# EAGLE design Shield_schematic_MMS (EAGLE 8.4.0)
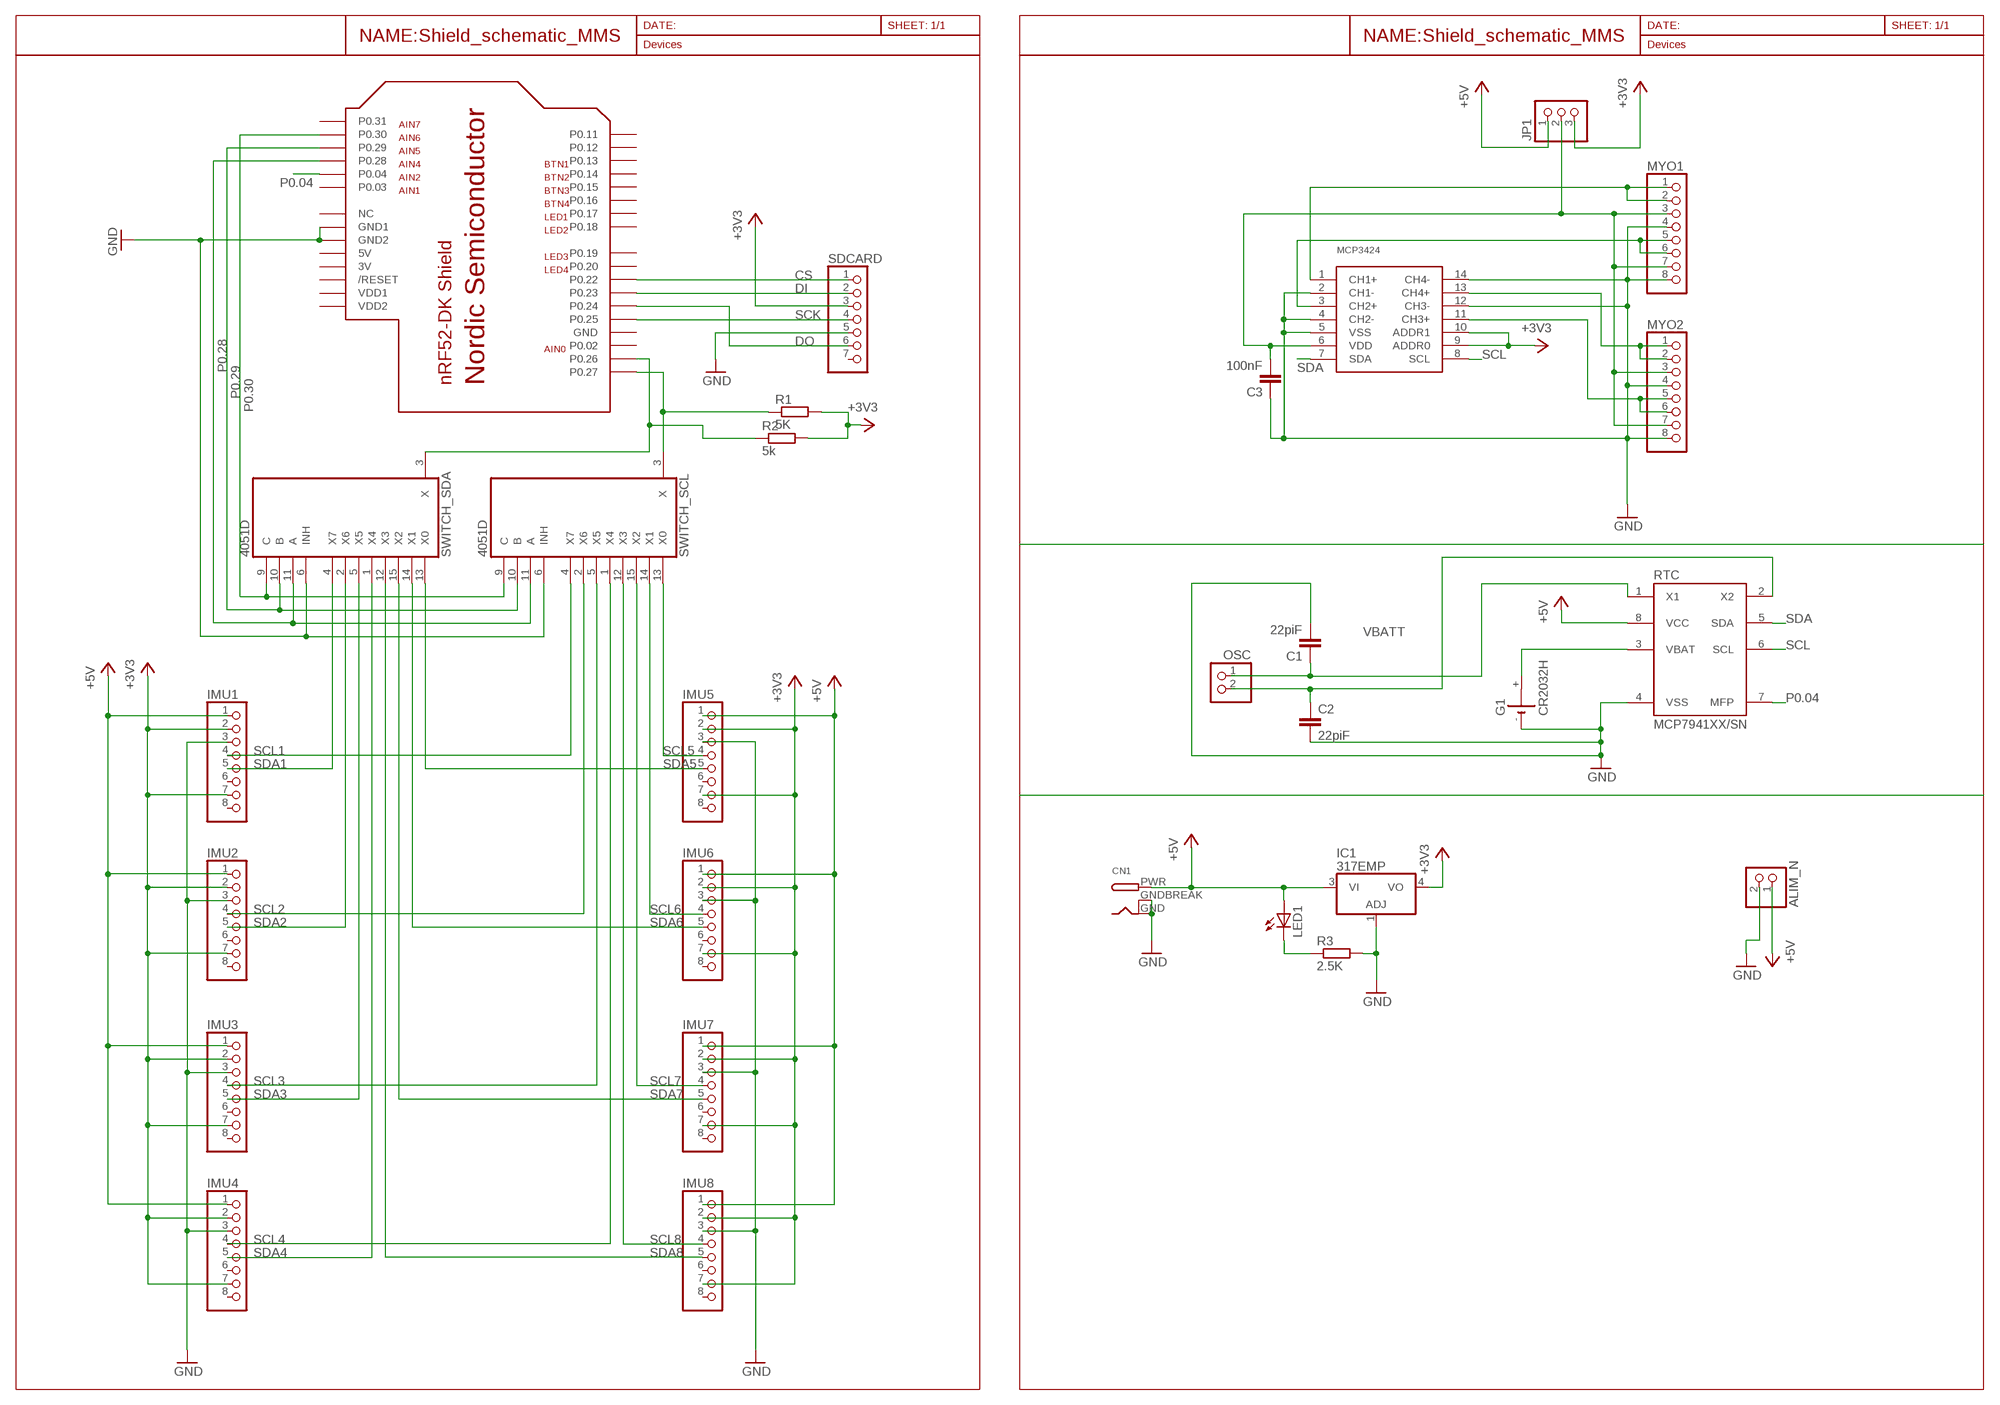
[diagram p0: schematic, sheet 1]

## Parts
ALIM_N  PINHD-1X2  [1X02]
C1  22piF  C2.5/2  [C2.5-2]
C2  22piF  C2.5/2  [C2.5-2]
C3  100nF  C2.5/2  [C2.5-2]
CN1  DCBARRELPTH  [DCJACK_2MM_PTH]
G1  CR2032H  [CR2032H]
IC1  317EMP  [SOT223]
IMU1  PINHD-1X8  [1X08]
IMU2  PINHD-1X8  [1X08]
IMU3  PINHD-1X8  [1X08]
IMU4  PINHD-1X8  [1X08]
IMU5  PINHD-1X8  [1X08]
IMU6  PINHD-1X8  [1X08]
IMU7  PINHD-1X8  [1X08]
IMU8  PINHD-1X8  [1X08]
JP1  PINHD-1X3  [1X03]
LED1  LEDCHIPLED_1206  [CHIPLED_1206]
MYO1  PINHD-1X8  [1X08]
MYO2  PINHD-1X8  [1X08]
OSC  PINHD-1X2  [1X02]
R1  5K  R-EU_M1206  [M1206]
R2  5k  R-EU_M1206  [M1206]
R3  2.5K  R-EU_M1206  [M1206]
RTC  MCP7941XX/SN  [SO8]
SDCARD  PINHD-1X7  [1X07]
SWITCH_SCL  4051D  [SO16]
SWITCH_SDA  4051D  [SO16]
U$2  NRF52-SHIELD-NOTEXT  [NRF52-SHIELD]
U$3  MCP3424  [SO14]

## Nets
+3V3: IC1.4(VO) IMU1.2 IMU1.7 IMU2.2 IMU2.7 IMU3.2 IMU3.7 IMU4.2 IMU4.7 IMU5.2 IMU5.7 IMU6.2 IMU6.7 IMU7.2 IMU7.7 IMU8.2 IMU8.7 JP1.3 R1.2 R2.2 SDCARD.3 U$3.9(ADDR0) U$3.10(ADDR1)
+5V: ALIM_N.1 CN1.PWR IC1.3(VI) IMU1.1 IMU2.1 IMU3.1 IMU4.1 IMU5.1 IMU6.1 IMU7.1 IMU8.1 JP1.1 LED1.A RTC.8(VCC)
CH1: MYO1.1 MYO1.2 U$3.1(CH1+)
CH2: MYO1.5 MYO1.6 U$3.3(CH2+)
CH3: MYO2.5 MYO2.6 U$3.11(CH3+)
CH4: MYO2.1 MYO2.2 U$3.13(CH4+)
CS: SDCARD.1 U$2.P22(P0.22)
DI: SDCARD.2 U$2.P23(P0.23)
DO: SDCARD.6 U$2.P24(P0.24)
GND: ALIM_N.2 C1.2 C2.2 C3.1 CN1.GND CN1.GNDBREAK G1.- IC1.1(ADJ) IMU1.3 IMU2.3 IMU3.3 IMU4.3 IMU5.3 IMU6.3 IMU7.3 IMU8.3 MYO1.4 MYO1.8 MYO2.4 MYO2.8 R3.2 RTC.4(VSS) SDCARD.5 SWITCH_SCL.6(INH) SWITCH_SDA.6(INH) U$2.GND1 U$2.GND2 U$3.2(CH1-) U$3.4(CH2-) U$3.5(VSS) U$3.12(CH3-) U$3.14(CH4-)
N$12: LED1.C R3.1
P0.04: RTC.7(MFP) U$2.P04(P0.04)
P0.28: SWITCH_SCL.11(A) SWITCH_SDA.11(A) U$2.P28(P0.28)
P0.29: SWITCH_SCL.10(B) SWITCH_SDA.10(B) U$2.P29(P0.29)
P0.30: SWITCH_SCL.9(C) SWITCH_SDA.9(C) U$2.P30(P0.30)
SCK: SDCARD.4 U$2.P25(P0.25)
SCL: R1.1 RTC.6(SCL) SWITCH_SCL.3(X) U$2.P27(P0.27) U$3.8(SCL)
SCL1: IMU1.4 SWITCH_SCL.4(X7)
SCL2: IMU2.4 SWITCH_SCL.2(X6)
SCL3: IMU3.4 SWITCH_SCL.5(X5)
SCL4: IMU4.4 SWITCH_SCL.1(X4)
SCL5: IMU5.4 SWITCH_SCL.13(X0)
SCL6: IMU6.4 SWITCH_SCL.14(X1)
SCL7: IMU7.4 SWITCH_SCL.15(X2)
SCL8: IMU8.4 SWITCH_SCL.12(X3)
SDA: R2.1 RTC.5(SDA) SWITCH_SDA.3(X) U$2.P26(P0.26) U$3.7(SDA)
SDA1: IMU1.5 SWITCH_SDA.4(X7)
SDA2: IMU2.5 SWITCH_SDA.2(X6)
SDA3: IMU3.5 SWITCH_SDA.5(X5)
SDA4: IMU4.5 SWITCH_SDA.1(X4)
SDA5: IMU5.5 SWITCH_SDA.13(X0)
SDA6: IMU6.5 SWITCH_SDA.14(X1)
SDA7: IMU7.5 SWITCH_SDA.15(X2)
SDA8: IMU8.5 SWITCH_SDA.12(X3)
VBATT: G1.+ RTC.3(VBAT)
VDD: C3.2 JP1.2 MYO1.3 MYO1.7 MYO2.3 MYO2.7 U$3.6(VDD)
X1: C1.1 OSC.1 RTC.1(X1)
X2: C2.1 OSC.2 RTC.2(X2)
Unconnected: G1.+@1(+) IMU1.6 IMU1.8 IMU2.6 IMU2.8 IMU3.6 IMU3.8 IMU4.6 IMU4.8 IMU5.6 IMU5.8 IMU6.6 IMU6.8 IMU7.6 IMU7.8 IMU8.6 IMU8.8 SDCARD.7 U$2.NC U$2.P02(P0.02) U$2.P03(P0.03) U$2.P11(P0.11) U$2.P12(P0.12) U$2.P13(P0.13) U$2.P14(P0.14) U$2.P15(P0.15) U$2.P16(P0.16) U$2.P17(P0.17) U$2.P18(P0.18) U$2.P19(P0.19) U$2.P20(P0.20) U$2.P31(P0.31) U$2.RESET(/RESET)

## Power pins joined to a net without a drawn wire
3V: U$2.3V
5V: U$2.5V
GND: SWITCH_SCL.8(GND) SWITCH_SDA.8(GND) U$2.GND
VCC: SWITCH_SCL.16(VCC) SWITCH_SDA.16(VCC)
VDD1: U$2.VDD2(VDD1)
VDD2: U$2.VDD1(VDD2)
VEE: SWITCH_SCL.7(VEE) SWITCH_SDA.7(VEE)

## Library data of the parts
ALIM_N OSC = pinhead:PINHD-1X2: PIN HEADER
C1-C3 = capacitor-wima:C: CAPACITOR naming: grid - package width
CN1 = adafruit:DCBARREL: 2.0mm DC Barrel Jack DCJACK_2MM_PTH - Through Hole Jack (4UConnector: 05537)
G1 = battery:CR2032H: LI BATTERY Varta
IC1 = linear:*317: Positive VOLTAGE REGULATOR
IMU1-IMU8 MYO1 MYO2 = pinhead:PINHD-1X8: PIN HEADER
JP1 = pinhead:PINHD-1X3: PIN HEADER
LED1 = adafruit:LED: LED OSRAM: - CHIPLED LG R971, LG N971, LY N971, LG Q971, LY Q971, LO R971, LY R971 LH N974, LH R974 LS Q976, LO Q976, LY Q976 LO Q996 - Hyper CHIPLED LW Q18S LB Q993, LB Q99A, LB R99A - SideLED LS A670, LO A670, LY A670, LG A670, LP A670 LB A673, LV A673, LT A673, LW A673 LH A674 LY A675 LS A676, LA A676, LO A676, LY A676, LW A676 LS A679, LY A679, LG A679 - Hyper Micro SIDELED® LS Y876, LA Y876, LO Y876, LY Y876 LT Y87S - SmartLED LW L88C, LW L88S LB L89C, LB L89S, LG L890 LS L89K, LO L89K, LY L89K LS L896, LA L896, LO L896, LY L896 - TOPLED LS T670, LO T670, LY T670, LG T670, LP T670 LSG T670, LSP T670, LSY T670, LOP T670, LYG T670 LG T671, LOG T671, LSG T671 LB T673, LV T673, LT T673, LW T673 LH T674 LS T676, LA T676, LO T676, LY T676, LB T676, LH T676, LSB T676, LW T676 LB T67C, LV T67C, LT T67C, LS T67K, LO T67K, LY T67K, LW E67C LS E67B, LA E67B, LO E67B, LY E67B, LB E67C, LV E67C, LT E67C LW T67C LS T679, LY T679, LG T679 LS T770, LO T770, LY T770, LG T770, LP T770 LB T773, LV T773, LT T773, LW T773 LH T774 LS E675, LA E675, LY E675, LS T675 LS T776, LA T776, LO T776, LY T776, LB T776 LHGB T686 LT T68C, LB T68C - Hyper Mini TOPLED® LB M676 - Mini TOPLED Santana® LG M470 LS M47K, LO M47K, LY M47K Source: http://www.osram.convergy.de/
R1-R3 = resistor:R-EU_: RESISTOR, European symbol
RTC = _hhn_MCP7941X:MCP7941*?: Microchip MCP79410 / MCP79411 / MCP79412 I²C Real Time CLock/Calendar with Unique ID Rev. 5.0.0 as of 2013-10-23, for EAGLE 5+ Changelog 5.0.0 (initial) MCP79410XI/YY X: Unique ID 0: blank 1: EUI-48 2: EUI-96 I: Temperature Range (Industrial) /YY: Package /MS: MSOP8_.65 (8-Lead Micro Small Outline Package, 0.65mm pitch) /SN: SOIC8 (8-Lead Small Outline [Narrow], 3.9mm body) /ST: TSSOP8 (8-Lead Thin Schrink Small Outline, 4.4mm body) Source: http://www.microchip.com Author: Dipl.-Ing. FH Rainer Bayer Heilbronn University HHN http://www.hs-heilbronn.de/rainer.bayer · rainer.bayer@hs-heilbronn.de Engineering office ing-rb: http://www.ing-rb.de/ · eagle@ing-rb.de Lectureship dozent-rb: http://www.dozent-rb.de/ · eagle@dozent-rb.de
SDCARD = pinhead:PINHD-1X7: PIN HEADER
SWITCH_SCL SWITCH_SDA = 40xx:4051: 8-channel ANALOG MULTIPLEXER
U$2 = nrf52-shield_modif:NRF52-SHIELD: nRF5 devkit shield
U$3 = mcp3424:MCP3424

## Board
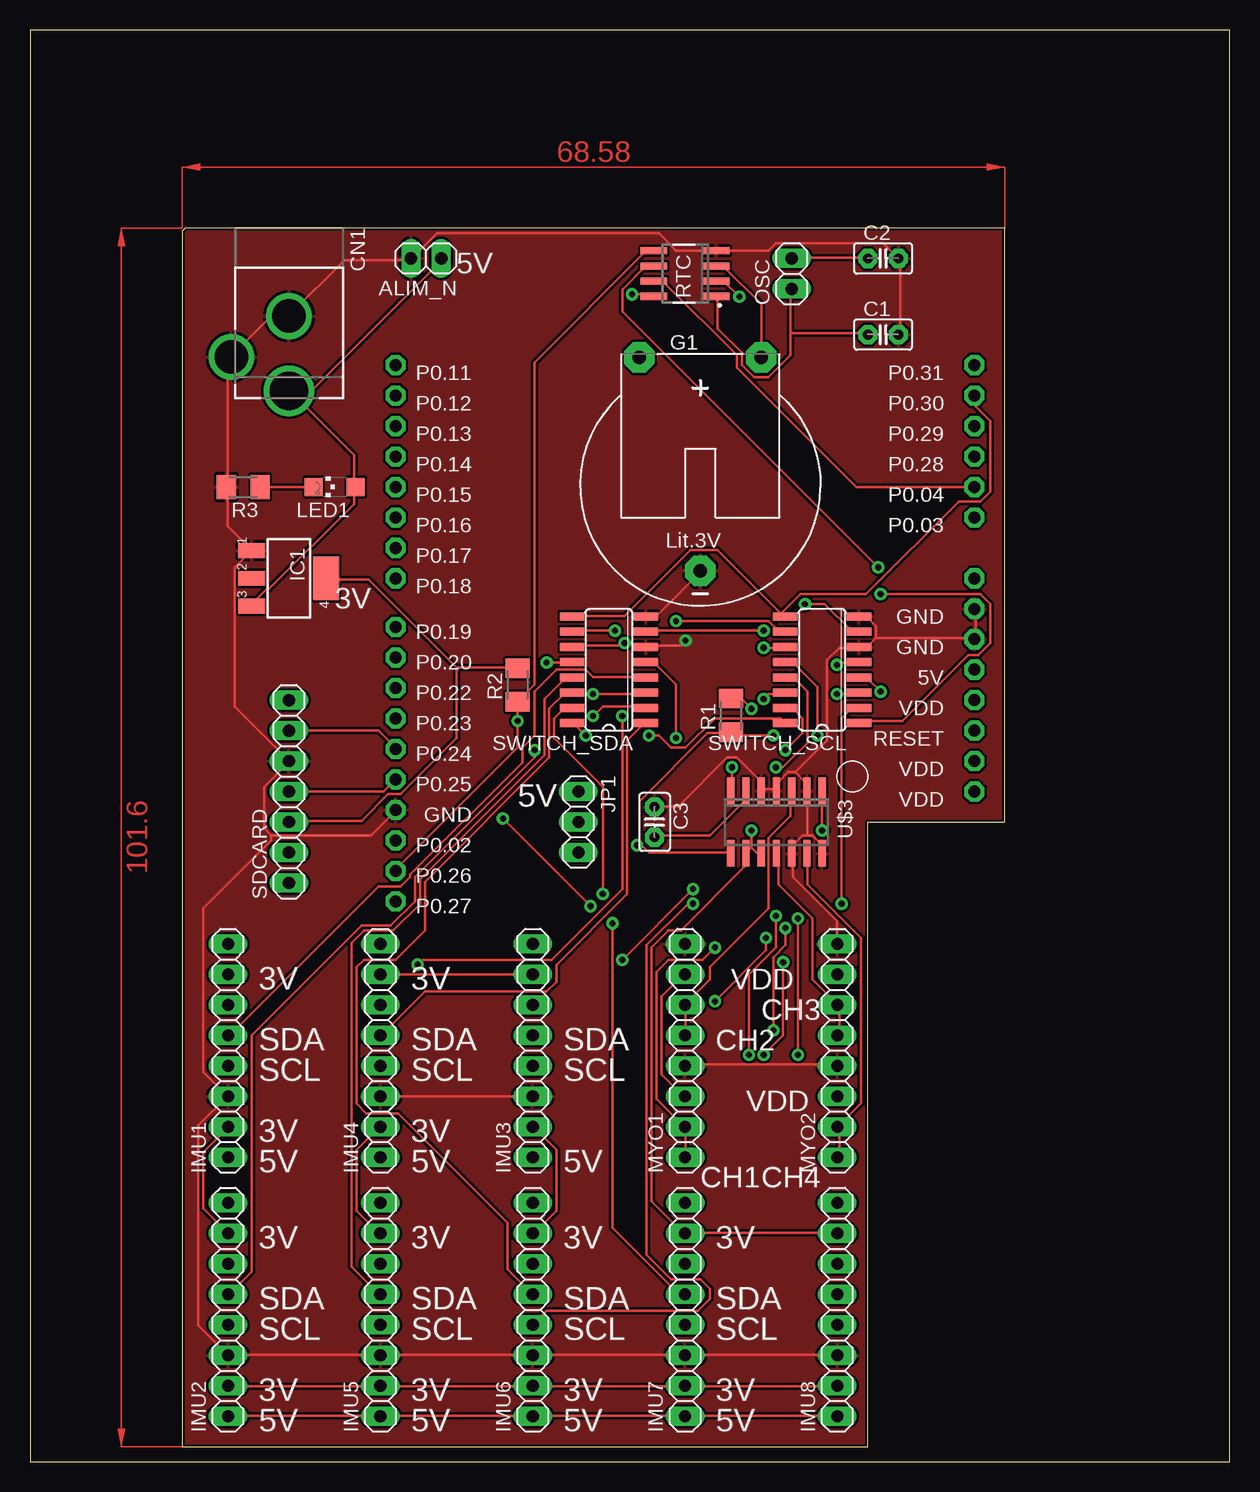
[diagram p1: board, top side]
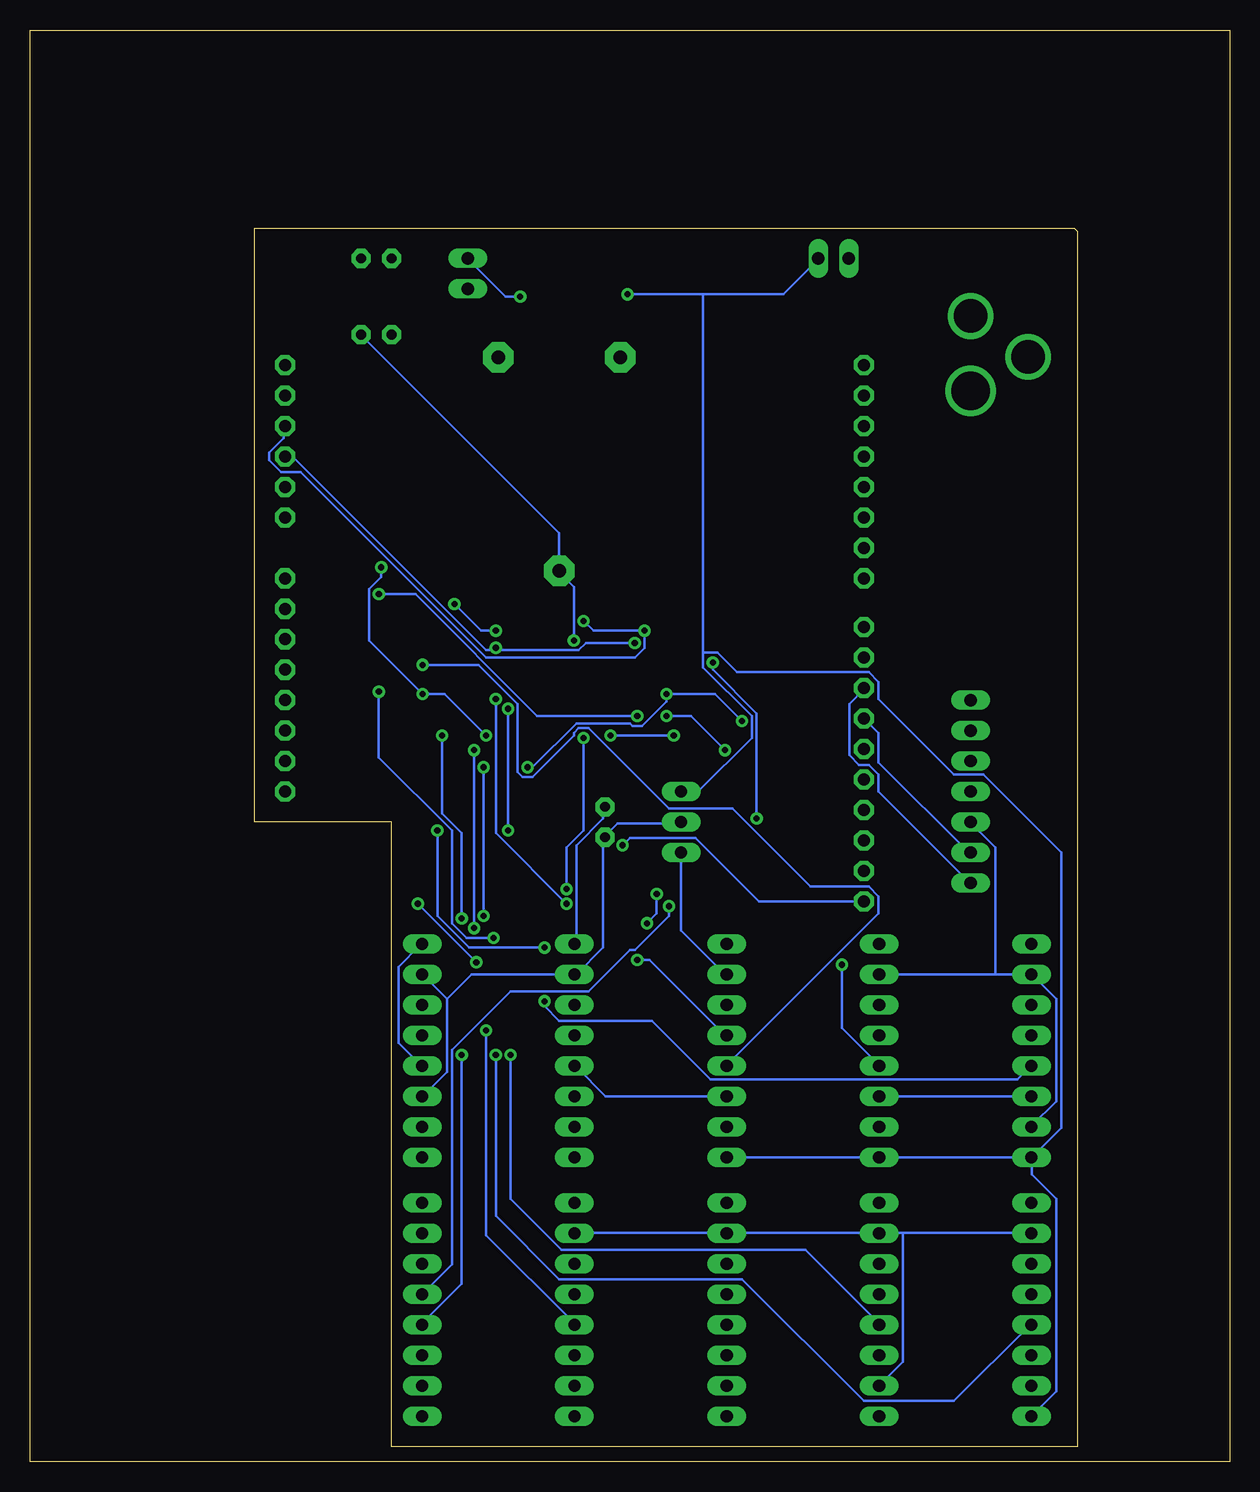
[diagram p2: board, bottom side, seen from below]

Size 100 x 119.37 mm. Coordinates in mm from the lower left corner, seen from the top.
Outline: 0,0 100,0 100,119.37 0,119.37 0,0
Copper layers (1*16): Top 0.035mm / dielectric 1.5mm / Bottom 0.035mm
Design rules "SparkFun": minimum track width 8mil, minimum drill 20mil, track to track 8mil, track to pad 8mil, pad to pad 8mil, via to via 8mil, smd to smd 8mil, copper to edge 8mil, drill to drill 8mil, minimum pad ring 12mil, minimum via ring 10mil, stop-mask expansion 4mil, vias tented up to drill 20mil, thermal gap 10mil

### Footprints (pad centres in the part's own frame; a part is rotated, then mirrored left to right if it is on the bottom)
1X02 = drill 1.016 long: 1 -1.27,0; 2 1.27,0
C2.5-2 = drill 0.813 pad 1.6 octagon: 1 -1.27,0; 2 1.27,0
DCJACK_2MM_PTH = drill 2.8: GND 0,7.35; GNDBREAK 4.8,10.75 | drill 3.2: PWR 0,13.6
CR2032H = drill 1.118 pad 2.54 octagon: + 5.08,10.795; +@1 -5.08,10.795; - 0,-6.985
SOT223 = smd 1.219 x 2.235: 1 -2.311,-3.099; 2 0,-3.099; 3 2.311,-3.099 | smd 3.6 x 2.2: 4 0,3.099
1X08 = drill 1.016 long: 1 -8.89,0; 2 -6.35,0; 3 -3.81,0; 4 -1.27,0; 5 1.27,0; 6 3.81,0; 7 6.35,0; 8 8.89,0
1X03 = drill 1.016 long: 1 -2.54,0; 2 0,0; 3 2.54,0
CHIPLED_1206 = smd 1.5 x 1.5: A 0,-1.75; C 0,1.75
M1206 = smd 1.6 x 2: 1 -1.4,0; 2 1.4,0
SO8 = smd 0.6 x 2.2: 1 -1.905,-2.6; 2 -0.635,-2.6; 3 0.635,-2.6; 4 1.905,-2.6; 5 1.905,2.6; 6 0.635,2.6; 7 -0.635,2.6; 8 -1.905,2.6
1X07 = drill 1.016 long: 1 -7.62,0; 2 -5.08,0; 3 -2.54,0; 4 0,0; 5 2.54,0; 6 5.08,0; 7 7.62,0
SO16 = smd 0.66 x 2.032: 1 -4.445,-3.073; 2 -3.175,-3.073; 3 -1.905,-3.073; 4 -0.635,-3.073; 5 0.635,-3.073; 6 1.905,-3.073; 7 3.175,-3.073; 8 4.445,-3.073; 9 4.445,3.073; 10 3.175,3.073; 11 1.905,3.073; 12 0.635,3.073; 13 -0.635,3.073; 14 -1.905,3.073; 15 -3.175,3.073; 16 -4.445,3.073
NRF52-SHIELD = drill 1 pad 1.676 octagon: 3V 62.23,1.27; 5V 64.77,1.27; GND 53.086,49.53; GND1 69.85,1.27; GND2 67.31,1.27; NC 72.39,1.27; P02 50.546,49.53; P03 77.47,1.27; P04 80.01,1.27; P11 90.17,49.53; P12 87.63,49.53; P13 85.09,49.53; P14 82.55,49.53; P15 80.01,49.53; P16 77.47,49.53; P17 74.93,49.53; P18 72.39,49.53; P19 68.326,49.53; P20 65.786,49.53; P22 63.246,49.53; P23 60.706,49.53; P24 58.166,49.53; P25 55.626,49.53; P26 48.006,49.53; P27 45.466,49.53; P28 82.55,1.27; P29 85.09,1.27; P30 87.63,1.27; P31 90.17,1.27; RESET 59.69,1.27; VDD1 57.15,1.27; VDD2 54.61,1.27
SO14 = smd 0.6 x 2.2: 1 -3.81,-2.6; 2 -2.54,-2.6; 3 -1.27,-2.6; 4 0,-2.6; 5 1.27,-2.6; 6 2.54,-2.6; 7 3.81,-2.6; 8 3.81,2.6; 9 2.54,2.6; 10 1.27,2.6; 11 0,2.6; 12 -1.27,2.6; 13 -2.54,2.6; 14 -3.81,2.6

### Placement (x,y rotation side)
ALIM_N  33.02,100.33 180 top
C1  71.12,93.98 0 top
C2  71.12,100.33 0 top
C3  52.07,53.34 270 top
CN1  21.59,102.87 180 top
G1  55.88,81.28 0 top
IC1  21.59,73.66 270 top
IMU1  16.51,34.29 90 top
IMU2  16.51,12.7 90 top
IMU3  41.91,34.29 90 top
IMU4  29.21,34.29 90 top
IMU5  29.21,12.7 90 top
IMU6  41.91,12.7 90 top
IMU7  54.61,12.7 90 top
IMU8  67.31,12.7 90 top
JP1  45.72,53.34 270 top
LED1  25.4,81.28 90 top
MYO1  54.61,34.29 90 top
MYO2  67.31,34.29 90 top
OSC  63.5,99.06 90 top
R1  58.42,62.23 90 top
R2  40.64,64.77 90 top
R3  17.78,81.28 180 top
RTC  54.61,99.06 90 top
SDCARD  21.59,55.88 90 top
SWITCH_SCL  66.04,66.04 90 top
SWITCH_SDA  48.26,66.04 90 top
U$2  80.01,1.27 90 top
U$3  62.23,53.34 180 top

### Tracks (layer width: path | path; a pad name or v marks a point on that pad's centre or on a via)
+3V3  (via drill 0.51)
  Top 0.203: 35.56,66.24 40.64,66.24 R2.2 | 35.56,66.24 28.25,73.56 24.79,73.56 IC1.4 | IMU4.7 IMU3.7 | 35.56,66.24 35.56,60.35 30.89,55.68 29.87,55.68 27.64,53.44 21.74,53.44 SDCARD.3 | IMU2.2 16.66,6.3 29.06,6.3 IMU5.2 29.26,6.3 41.86,6.3 IMU6.2 42.06,6.3 54.46,6.3 IMU7.2 54.66,6.3 67.26,6.3 IMU8.2 | IMU2.7 14.43,21.13 14.43,25.81 16.46,27.84 IMU1.2 | IMU5.7 29.06,19.1 27.23,20.93 27.23,26.01 29.06,27.84 IMU4.2 | v60.15,62.79 59.33,63.6 58.52,63.6 R1.2 | 60.15,51.21 v60.15,52.63 | 60.15,51.21 59.74,50.8 U$3.9 59.54,50.6 59.54,49.58 54.25,44.3 53.24,44.3 51.82,42.88 51.82,21.74 54.46,19.1 IMU7.7 54.66,19.1 67.26,19.1 IMU8.7 | 60.15,51.21 60.55,50.8 60.96,50.8 U$3.10 | IMU6.7 42.06,19.1 43.89,20.93 43.89,26.01 42.06,27.84 IMU3.2
  Bottom 0.203: JP1.3 45.72,44.3 42.06,40.64 IMU3.7 | IMU4.7 19.51,40.64 | 19.51,40.64 IMU1.7 16.46,40.64 14.43,38.61 14.43,30.07 16.46,28.04 IMU1.2 | 19.51,40.64 19.51,51.21 21.54,53.24 SDCARD.3 | 27.23,19.1 29.06,19.1 IMU5.7 29.26,19.1 41.86,19.1 IMU6.7 42.06,19.1 54.46,19.1 IMU7.7 | 27.23,19.1 16.66,19.1 IMU2.7 | v60.15,52.63 v60.15,62.79 | IMU5.2 27.23,8.33 27.23,19.1
+5V  (via drill 0.51)
  Top 0.203: IMU2.1 16.66,3.86 29.06,3.86 IMU5.1 29.26,3.86 41.86,3.86 IMU6.1 42.06,3.86 54.46,3.86 IMU7.1 54.66,3.86 67.26,3.86 IMU8.1 | 27.03,81.28 27.03,83.92 22.55,88.39 | 22.55,88.39 21.74,89.2 CN1.PWR 22.55,88.39 | 27.03,81.28 27.03,79.86 19.91,72.75 19.71,72.75 18.49,71.53 IC1.3 | 27.03,81.28 LED1.A | v50.19,97.33 51.82,97.33 RTC.8 | 22.55,88.39 34.34,100.18 ALIM_N.1
  Bottom 0.203: IMU3.1 IMU4.1 IMU1.1 16.46,25.4 | 16.46,25.4 16.46,23.98 14.43,21.95 14.43,5.89 IMU2.1 | 43.89,97.33 37.19,97.33 34.34,100.18 ALIM_N.1 | 43.89,97.33 v50.19,97.33 | JP1.1 44.3,55.88 39.83,60.35 39.83,62.18 43.89,66.24 43.89,67.46 | 43.89,97.33 43.89,67.46 | 16.46,25.4 14.02,27.84 14.02,50.8 20.52,57.3 22.96,57.3 29.26,63.6 29.26,65.02 30.07,65.84 41.05,65.84 42.67,67.46 43.89,67.46
CH1  (via drill 0.51)
  Top 0.203: v66.04,52.63 U$3.1 | v57.1,42.88 56.08,41.86 53.24,41.86 52.22,40.84 52.22,30.28 54.46,28.04 MYO1.2 54.66,27.84 54.66,25.4 MYO1.1
  Bottom 0.203: v66.04,52.63 66.04,45.52 63.4,42.88 v57.1,42.88
CH2
  Top 0.203: U$3.3 63.4,55.88 63.4,53.85 61.57,52.02 61.57,46.13 56.69,41.25 56.69,40.23 54.66,38.2 MYO1.6 54.66,38 54.66,35.56 MYO1.5
CH3
  Top 0.203: U$3.11 62.38,50.6 62.38,48.16 65.23,45.31 65.23,40.23 67.26,38.2 MYO2.6 67.46,38 67.46,35.56 MYO2.5
CH4
  Top 0.203: U$3.13 64.82,50.6 64.82,48.16 69.29,43.69 69.29,29.87 67.46,28.04 MYO2.2 67.46,27.84 67.46,25.4 MYO2.1
CS
  Bottom 0.203: SDCARD.1 21.74,48.36 29.26,55.88 29.26,57.3 30.07,58.12 30.89,58.12 31.7,58.93 31.7,63.2 30.48,64.41 U$2.P22
DI
  Bottom 0.203: U$2.P23 29.26,60.76 29.26,58.32 21.74,50.8 SDCARD.2
DO
  Top 0.203: SDCARD.6 29.06,60.96 30.48,59.54 U$2.P24
GND  (via drill 0.51)
  Top 0.203: v54.66,68.48 54.25,68.07 51.41,68.07 SWITCH_SDA.6 | SWITCH_SDA.8 51.41,70.51 52.22,70.51 55.88,74.17 G1.- | C1.2 72.54,94.08 72.54,100.18 C2.2 71.12,101.6 62.18,101.6 61.57,100.99 57.3,100.99 RTC.4 57.1,100.99 53.85,100.99 52.43,102.41 33.93,102.41 31.9,100.38 ALIM_N.2 31.7,100.18 26.21,100.18 21.74,95.71 CN1.GND 21.54,95.5 20.12,95.5 16.87,92.25 CN1.GNDBREAK 16.66,92.05 16.46,91.85 16.46,81.28 | 20.12,52.22 19.51,52.83 19.51,56.29 21.54,58.32 SDCARD.5 21.54,58.52 17.07,62.99 17.07,74.57 18.49,76 | 20.12,52.22 28.45,52.22 30.48,54.25 U$2.GND | 16.46,81.28 16.46,78.03 18.49,76 | 16.46,81.28 R3.2 | 18.49,76 IC1.1 | IMU8.3 67.26,8.94 54.66,8.94 IMU7.3 54.46,8.94 42.06,8.94 IMU6.3 41.86,8.94 29.26,8.94 IMU5.3 29.06,8.94 16.66,8.94 IMU2.3 14.02,11.38 14.02,28.04 16.46,30.48 | IMU4.3 IMU3.3 | MYO1.4 54.66,33.12 67.26,33.12 MYO2.4 | 70.51,68.68 69.9,68.07 69.29,68.07 SWITCH_SCL.6 69.09,67.87 67.46,67.87 66.45,66.85 66.45,60.15 63.8,57.51 | 70.51,68.68 70.51,69.7 69.9,70.31 69.29,70.31 SWITCH_SCL.8 | 70.51,68.68 78.64,68.68 U$2.GND2 78.84,68.68 78.84,71.12 U$2.GND1 | 60.96,56.08 62.18,56.08 U$3.4 62.38,56.08 62.38,56.69 63.2,57.51 63.8,57.51 | 64.82,52.22 65.23,52.22 66.04,51.41 U$3.14 | 64.82,52.22 64.41,52.22 63.6,51.41 63.6,50.8 U$3.12 63.6,50.6 63.6,48.77 67.26,45.11 67.26,43.28 MYO2.8 | 64.82,52.22 64.82,55.88 U$3.2 64.62,56.08 64.62,56.69 63.8,57.51 | 60.96,56.08 60.96,56.69 58.93,58.73 58.12,58.73 54.05,54.66 52.22,54.66 C3.1 | 60.96,56.08 U$3.5 | 20.12,52.22 20.12,51.82 14.43,46.13 14.43,32.51 16.46,30.48 | 16.46,30.48 IMU1.3
  Bottom 0.203: v54.66,68.48 54.66,72.95 55.88,74.17 G1.- 55.88,77.42 72.34,93.88 C1.2 | IMU4.3 IMU1.3 | C3.1 52.22,54.46 52.22,53.65 54.46,51.41 54.46,43.28 MYO1.8 | MYO2.4 67.46,33.12 69.29,34.95 69.29,41.25 67.46,43.08 MYO2.8 | IMU3.3 52.02,30.48 54.46,32.92 MYO1.4
  pour Top: 12.7,102.87 81.28,102.87 81.28,53.34 69.85,53.34 69.85,1.27 12.7,1.27
N$12
  Top 0.203: R3.1 LED1.C
P0.04
  Top 0.203: U$2.P04 68.89,81.28 58.93,91.24 58.93,92.25 52.83,98.35 52.02,98.35 RTC.7
P0.28  (via drill 0.51)
  Top 0.203: v49.58,68.28 49.38,68.07 45.31,68.07 SWITCH_SDA.11 | v61.16,67.87 62.79,67.87 SWITCH_SCL.11
  Bottom 0.203: v49.58,68.28 53.65,68.28 54.25,67.67 61.16,67.67 | 61.16,67.67 61.98,67.67 78.03,83.72 78.64,83.72 U$2.P28 | 61.16,67.67 v61.16,67.87
P0.29  (via drill 0.51)
  Top 0.203: v48.77,69.29 45.31,69.29 SWITCH_SDA.10 | v53.85,70.1 61.57,70.1 62.38,69.29 62.79,69.29 SWITCH_SCL.10
  Bottom 0.203: v53.85,70.1 53.03,69.29 v48.77,69.29 48.77,67.87 49.58,67.06 61.98,67.06 77.42,82.5 79.05,82.5 80.06,83.52 80.06,84.12 78.84,85.34 78.84,86.36 U$2.P29
P0.30
  Top 0.203: 62.59,70.71 62.79,70.51 SWITCH_SCL.9 62.59,70.71 | 62.59,70.71 57.3,76 55.07,76 49.58,70.51 45.31,70.51 SWITCH_SDA.9 | 62.59,70.71 64.21,72.34 69.7,72.34 77.42,80.06 79.25,80.06 80.06,80.87 80.06,86.77 78.84,87.99 78.84,88.8 U$2.P30
SCK
  Top 0.203: SDCARD.4 29.46,55.88 U$2.P25
SCL  (via drill 0.51)
  Top 0.203: 50.8,51.61 50.8,55.07 56.49,60.76 58.32,60.76 R1.1 58.52,60.76 58.73,60.55 v61.98,60.55 | 50.8,51.61 51.61,50.8 58.32,50.8 U$3.8 | v67.26,64.01 69.09,64.01 SWITCH_SCL.3 | v70.71,74.57 49.38,95.91 49.38,97.74 51.21,99.57 51.82,99.57 RTC.6 | 50.8,51.61 v50.6,51.41
  Bottom 0.203: v61.98,60.55 65.43,64.01 v67.26,64.01 71.73,68.48 71.73,72.75 70.71,73.76 v70.71,74.57 | U$2.P27 39.22,46.74 44.5,52.02 49.99,52.02 v50.6,51.41
SCL1  (via drill 0.51)
  Top 0.203: v70.92,64.21 69.9,65.23 69.29,65.23 SWITCH_SCL.4 | v61.37,43.69 61.37,42.67 v57.1,38.41
  Bottom 0.203: v70.92,64.21 70.92,58.73 64.82,52.63 64.82,44.91 63.6,43.69 v61.37,43.69 | v57.1,38.41 57.1,38 55.88,36.78 48.16,36.78 43.28,31.9 17.68,31.9 16.66,32.92 IMU1.4
SCL2  (via drill 0.51)
  Top 0.203: v67.67,46.53 67.67,61.98 68.48,62.79 69.09,62.79 SWITCH_SCL.2 | v62.79,41.66 62.79,35.56 v61.16,33.93
  Bottom 0.203: v62.79,41.66 v67.67,46.53 | v61.16,33.93 61.16,20.52 55.88,15.24 40.64,15.24 30.48,5.08 22.96,5.08 16.66,11.38 IMU2.4
SCL3  (via drill 0.51)
  Top 0.203: v67.26,66.45 67.46,66.65 69.09,66.65 SWITCH_SCL.5
  Bottom 0.203: v67.26,66.45 62.59,66.45 59.33,63.2 59.33,57.51 58.93,57.1 58.12,57.1 54.66,60.55 54.66,60.76 54.25,61.16 53.44,61.16 46.74,54.46 41.45,54.46 34.95,47.95 30.07,47.95 29.26,47.14 29.26,45.72 41.86,33.12 IMU3.4
SCL4  (via drill 0.51)
  Top 0.203: v70.92,72.34 79.25,72.34 80.06,71.53 80.06,68.28 79.05,67.26 78.23,67.26 72.75,61.77 69.29,61.77 SWITCH_SCL.1 | v49.38,62.18 49.38,47.75 43.48,41.86 32.72,41.86 v32.31,41.45
  Bottom 0.203: v70.92,72.34 67.87,72.34 57.71,62.18 v49.38,62.18 | v32.31,41.45 32.31,36.17 29.26,33.12 IMU4.4
SCL5  (via drill 0.51)
  Top 0.203: v62.18,57.91 62.79,57.91 64.82,59.94 64.82,64.21 63.8,65.23 62.99,65.23 SWITCH_SCL.13 | v62.18,45.52 62.18,42.88 59.94,40.64 v59.94,33.93
  Bottom 0.203: v62.18,45.52 v62.18,57.91 | v59.94,33.93 59.94,21.95 55.68,17.68 35.36,17.68 29.26,11.58 IMU5.4
SCL6  (via drill 0.51)
  Top 0.203: v61.16,63.6 61.57,64.01 62.79,64.01 SWITCH_SCL.14 | v55.27,46.53 54.86,46.53 51.41,43.08 51.41,17.27 53.44,15.24 55.88,15.24 56.69,14.43 56.69,13.61 55.68,12.6 43.08,12.6 IMU6.4
  Bottom 0.203: v61.16,63.6 61.16,52.43 v55.27,46.53
SCL7  (via drill 0.51)
  Top 0.203: v62.99,59.33 64.41,60.76 64.41,61.98 63.6,62.79 62.99,62.79 SWITCH_SCL.15 | v62.99,44.5 62.99,43.08 61.98,42.06 v61.98,35.97
  Bottom 0.203: v62.99,44.5 v62.99,59.33 | v61.98,35.97 61.98,18.9 54.66,11.58 IMU7.4
SCL8  (via drill 0.51)
  Top 0.203: v65.63,60.55 65.63,64.62 63.6,66.65 62.99,66.65 SWITCH_SCL.12 | v64.01,33.93 v64.01,45.31
  Bottom 0.203: v65.63,60.55 65.63,54.05 64.01,52.43 v64.01,45.31 | v64.01,33.93 64.01,14.83 67.26,11.58 IMU8.4
SDA  (via drill 0.51)
  Top 0.203: U$2.P26 30.48,49.38 40.64,59.54 v40.64,61.77 R2.1 40.64,63.4 42.06,64.82 42.06,91.64 51.21,100.79 51.82,100.79 RTC.5 | v46.94,64.01 51.21,64.01 SWITCH_SDA.3 | v58.52,57.91 58.52,56.08 U$3.7
  Bottom 0.203: v40.64,61.77 42.88,64.01 v46.94,64.01 46.94,63.4 48.97,61.37 49.78,61.37 49.99,61.57 54.46,61.57 58.12,57.91 v58.52,57.91
SDA1
  Top 0.203: SWITCH_SDA.4 51.21,65.43 46.94,65.43 46.33,66.04 43.89,66.04 42.06,64.21 42.06,60.55 41.05,59.54 41.05,58.32 31.7,48.97 31.7,48.77 30.89,47.95 29.06,47.95 16.66,35.56 IMU1.5
SDA2  (via drill 0.51)
  Top 0.203: v46.94,62.18 47.75,62.99 51.21,62.99 SWITCH_SDA.2 | v42.06,59.33 42.06,58.73 32.11,48.77 32.11,46.74 30.07,44.7 27.64,44.7 18.49,35.56 18.49,15.85 16.66,14.02 IMU2.5
  Bottom 0.203: v46.94,62.18 44.91,62.18 v42.06,59.33
SDA3  (via drill 0.51)
  Top 0.203: v53.85,60.35 53.85,64.82 52.02,66.65 51.41,66.65 SWITCH_SDA.5 | v49.38,41.86 v55.27,47.75
  Bottom 0.203: v53.85,60.35 53.85,52.63 55.27,51.21 v55.27,47.75 | v49.38,41.86 48.36,41.86 42.06,35.56 IMU3.5
SDA4
  Top 0.203: SWITCH_SDA.1 51.21,61.57 49.78,60.15 49.78,47.35 43.89,41.45 43.89,40.03 43.08,39.22 32.92,39.22 29.26,35.56 IMU4.5
SDA5
  Top 0.203: SWITCH_SDA.13 45.11,65.23 44.5,65.23 42.88,63.6 42.88,58.93 32.51,48.56 32.51,46.53 30.28,44.3 27.84,44.3 26.82,43.28 26.82,16.26 29.06,14.02 IMU5.5
SDA6
  Top 0.203: IMU6.5 39.83,16.05 39.83,19.91 30.68,29.06 28.04,29.06 27.23,29.87 27.23,41.25 27.84,41.86 30.48,41.86 32.92,44.3 32.92,48.36 43.28,58.73 43.28,62.79 44.5,64.01 45.11,64.01 SWITCH_SDA.14
SDA7  (via drill 0.51)
  Top 0.203: v47.75,47.35 47.75,56.29 43.69,60.35 43.69,61.98 44.5,62.79 45.11,62.79 SWITCH_SDA.15 | v48.56,44.91 48.56,19.51 54.05,14.02 54.46,14.02 IMU7.5
  Bottom 0.203: v47.75,47.35 47.75,45.72 v48.56,44.91
SDA8  (via drill 0.51)
  Top 0.203: v43.08,66.65 45.11,66.65 SWITCH_SDA.12 | v46.74,46.33 v39.42,53.65
  Bottom 0.203: v43.08,66.65 43.08,66.04 39.42,62.38 v39.42,53.65 | v46.74,46.33 46.74,45.52 49.58,42.67 49.99,42.67 53.44,39.22 59.94,39.22 64.82,34.34 64.82,16.46 IMU8.5
VBATT
  Top 0.203: G1.+ 60.96,96.52 57.91,99.57 57.3,99.57 RTC.3
VCC  (via drill 0.51)
  Top 0.203: v46.33,60.55 45.31,61.57 SWITCH_SDA.16 | v51.61,60.55 52.43,60.55 53.44,59.54 54.66,59.54 57.1,61.98 62.59,61.98 SWITCH_SCL.16
  Bottom 0.203: v51.61,60.55 v46.33,60.55
VDD
  Top 0.203: U$3.6 59.54,55.88 59.54,55.07 56.69,52.22 52.22,52.22 C3.2 | MYO1.3 54.46,30.48 52.63,32.31 52.63,38.81 54.46,40.64 MYO1.7
  Bottom 0.203: JP1.2 45.72,53.24 51,53.24 52.02,52.22 C3.2 52.22,52.02 52.22,42.88 54.46,40.64 MYO1.7 63.2,40.64 65.23,38.61 | 65.23,38.61 65.23,32.51 67.26,30.48 MYO2.3 | 65.23,38.61 67.26,40.64 MYO2.7
VEE  (via drill 0.51)
  Top 0.203: v61.16,69.29 51.41,69.29 SWITCH_SDA.7 | v64.62,71.53 66.24,71.53 68.48,69.29 69.09,69.29 SWITCH_SCL.7
  Bottom 0.203: v61.16,69.29 62.38,69.29 v64.62,71.53
X1
  Top 0.203: 63.4,94.08 63.4,97.74 OSC.1 | 63.4,94.08 63.4,92.25 61.57,90.42 60.35,90.42 59.33,91.44 59.33,92.46 57.3,94.49 57.3,97.13 RTC.1 | 63.4,94.08 69.7,94.08 C1.1
X2  (via drill 0.51)
  Top 0.203: v59.13,97.13 57.91,98.35 57.3,98.35 RTC.2 | C2.1 69.7,100.38 63.6,100.38 OSC.2
  Bottom 0.203: v59.13,97.13 60.35,97.13 63.4,100.18 OSC.2
(copper drawn outside any net)
  shapes: Top area x2

### Text on the board
tPlace: 5V | 3V | 5V | 3V | 3V | VDD | CH3 | SDA | SDA | SDA | CH2 | SCL | SCL | SCL | VDD | 3V | 3V | 5V | 5V | 5V | CH1 | CH4 | 3V | 3V | 3V | 3V | SDA | SDA | SDA | SDA | SCL | SCL | SCL | SCL | 3V | 3V | 3V | 3V | 5V | 5V | 5V | 5V